# Altium schematic sheet Accelerometers.SchDoc
size Letter
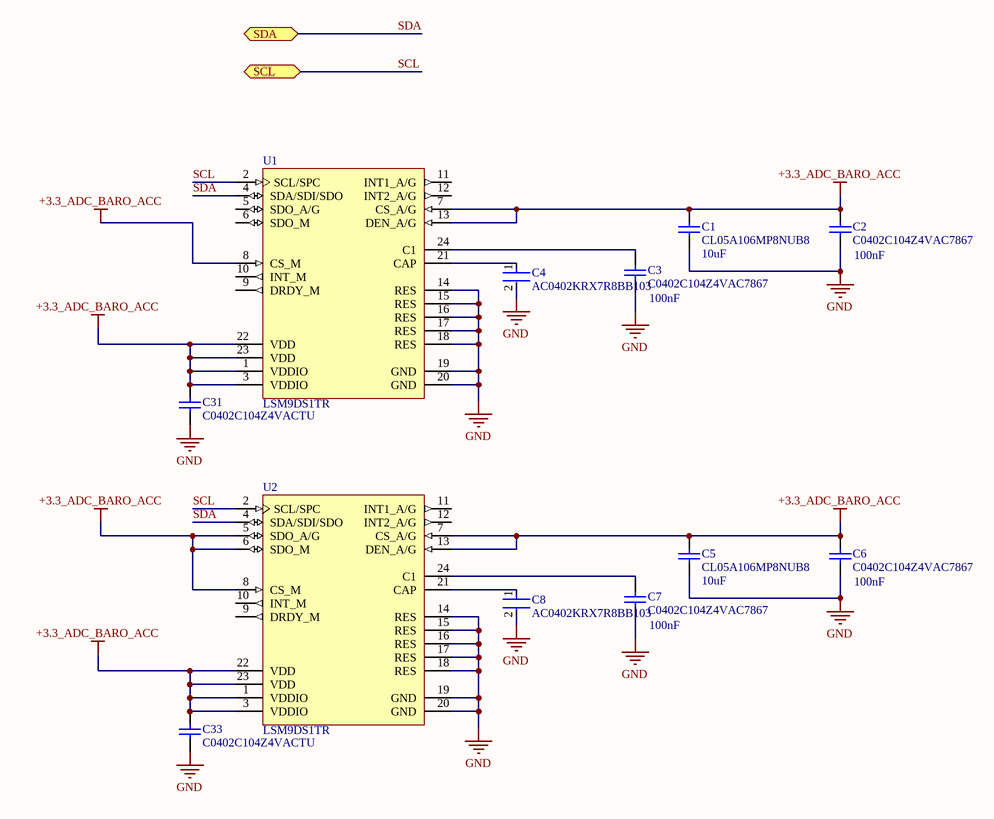
[diagram p0: Accelerometers.SchDoc]

## Parts
C1  CL05A106MP8NUB8  value 10uF  [0402]
C2  C0402C104Z4VAC7867  Spec: 100nF  [CAPC1005X60X30LL05T10]
C3  C0402C104Z4VAC7867  Spec: 100nF  [CAPC1005X60X30LL05T10]
C4  AC0402KRX7R8BB103  [FP-AC0402-0_5-MFG]
C5  CL05A106MP8NUB8  value 10uF  [0402]
C6  C0402C104Z4VAC7867  Spec: 100nF  [CAPC1005X60X30LL05T10]
C7  C0402C104Z4VAC7867  Spec: 100nF  [CAPC1005X60X30LL05T10]
C8  AC0402KRX7R8BB103  [FP-AC0402-0_5-MFG]
C31  C0402C104Z4VACTU  [CAPC1005X55X30LL05T10]
C33  C0402C104Z4VACTU  [CAPC1005X55X30LL05T10]
U1  LSM9DS1TR  [STM-LGA-24_3500X3000X1000]
U2  LSM9DS1TR  [STM-LGA-24_3500X3000X1000]

## Ports
SCL (bidir), SDA (bidir)

## Nets
+3.3_ADC_BARO_ACC: C1.2 C2.2 C5.2 C6.2 C31.2 C33.2 U1.1(VDDIO) U1.3(VDDIO) U1.7(CS_A/G) U1.8(CS_M) U1.13(DEN_A/G) U1.22(VDD) U1.23(VDD) U2.1(VDDIO) U2.3(VDDIO) U2.5(SDO_A/G) U2.6(SDO_M) U2.7(CS_A/G) U2.8(CS_M) U2.13(DEN_A/G) U2.22(VDD) U2.23(VDD)
GND: C1.1 C2.1 C3.1 C4.2 C5.1 C6.1 C7.1 C8.2 C31.1 C33.1 U1.14(RES) U1.15(RES) U1.16(RES) U1.17(RES) U1.18(RES) U1.19(GND) U1.20(GND) U2.14(RES) U2.15(RES) U2.16(RES) U2.17(RES) U2.18(RES) U2.19(GND) U2.20(GND)
SCL: U1.2(SCL/SPC) U2.2(SCL/SPC) ; port SCL
SDA: U1.4(SDA/SDI/SDO) U2.4(SDA/SDI/SDO) ; port SDA
NetC3_2: C3.2 U1.24(C1)
NetC4_1: C4.1 U1.21(CAP)
NetC7_2: C7.2 U2.24(C1)
NetC8_1: C8.1 U2.21(CAP)

Not connected (* = marked no-connect by the designer): U1 5(SDO_A/G) 6(SDO_M) 9(DRDY_M) 10(INT_M) 11(INT1_A/G) 12(INT2_A/G); U2 9(DRDY_M) 10(INT_M) 11(INT1_A/G) 12(INT2_A/G)

## Notes on the sheet
- Title
- Size:
- Date:
- Letter
- Number:
- Time:
- Revision:
- Sheet
- of
- Rocket Propulsion Laboratory
- UC San Diego
- Avionics Team
- Author :
- File:

## Library data of the parts
C1 C5 = Cap: Capacitor; Published: 8-Jun-2000; LatestRevisionDate: 17-Jul-2002; LatestRevisionNote: Re-released for DXP Platform.; PackageReference: RAD-0.3; Publisher: Altium Limited; PackageDescription: Radial Cap, Thru-Hole; 2 Leads; 0.3 in Pin Spacing
C2 C3 C6 C7 = CMP-2008-02369-1: Manufacturer: Kemet; Part Number: C0402C104Z4VAC7867
C4 C8 = CMP-03422-001250-1: CAP CER 10000PF 25V X7R 0402; Manufacturer: Yageo; Capacitance: 10 nF; Value: 10 nF; Material: Ceramic; Automotive Grade: Grade 1; Tolerance: 0.1; Temperature Coefficient: ±15%; Device Class L2: Capacitors; Temperature: -55°C to +125°C; Temperature Characteristic: X7R; Automotive: Yes; Lead Free: Yes; Ipc Land Pattern Name: CAPC10050X50; ComponentLink2Description: Datasheet; Temperature Range High: +125°C; ComponentLink2URL: http://www.yageo.com/documents/recent/UPY-AC_NP0X7R_16V-to-630V_12.pdf; Category: Cap; Octopart: https://octopart.com/ac0402krx7r8bb103-yageo-75666114; Device Class L1: Passive Components; Digikey Description: CAP CER 10000PF 25V X7R 0402; Footprint Url: http://www.yageo.com/exep/pages/download/literatures/UPY-C_GEN_24.pdf; Voltage Rating: 25 V; Temperature Range Low: -55°C; Height: 0.55mm; Manufacturer Part Number: AC0402KRX7R8BB103; RoHS: TRUE; Device Class L3: Ceramic Capacitors; Package: AC0402-0.5
C31 C33 = CMP-2008-03088-1: Manufacturer: Kemet; Part Number: C0402C104Z4VACTU
U1 U2 = CMP-2000-06606-1: iNEMO Inertial Module: 3D Accelerometer, 3D Gyroscope, 3D Magnetometer, 1.9 to 3.6 V, -40 to 85 degC, 24-Pin LGA, RoHS, Tape and Reel; Manufacturer: STMicroelectronics; SVHC: NoSVHC(17-Dec-2015); MEMS Module Function: Tri-AxisGyroscope,Tri-AxisAccelerometer,Tri-AxisMagnetometer; Supply Voltage Max: 3.6V; No. of Pins: 24Pins; Gyroscope Range: ±245°/s,±500°/s,±2000°/s; Acceleration Range: ±2g,±4g,±8g,±16g; Supply Voltage Min: 1.9V; Package Description: 24-Pin Plastic Land Grid Array Package, Body 3.65 x 3.15 mm, Pitch 0.43 mm; Manufacturer URL: http://www.st.com/; PartNumber: LSM9DS1; Product Range: -; Packaging: CutTape; Sensor Case Style: LGA; Datasheet URL: http://www2.st.com/content/ccc/resource/technical/document/datasheet/1e/3f/2a/d6/25/eb/48/46/DM00103319.pdf/files/DM00103319.pdf/jcr:content/translations/en.DM00103319.pdf; Package Reference: LGA-24_3500X3000X1000; Mounting Technology: SurfaceMount; Datasheet Version: Rev. 3, 03/2015; MSL: MSL3-168hours